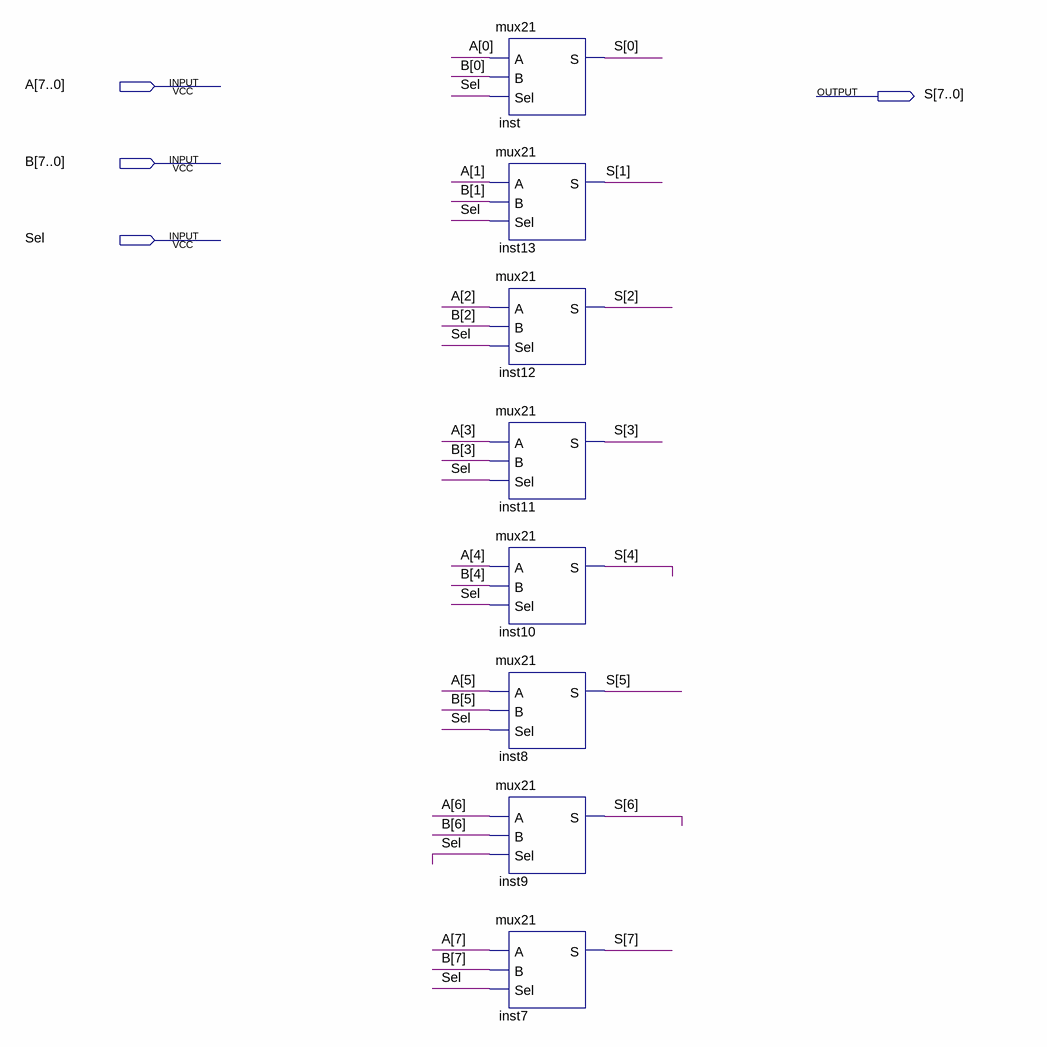
[diagram p0: schematic sheet]
// Quartus schematic lab02.bdf as structural Verilog: 8 symbols, 4 pins
module lab02 (
  input  [7:0] A,
  input  [7:0] B,
  input  Sel,
  output [7:0] S
);

  mux21 inst (.A(A[0]), .B(B[0]), .Sel(Sel), .S(S[0]));
  mux21 inst13 (.A(A[1]), .B(B[1]), .Sel(Sel), .S(S[1]));
  mux21 inst12 (.A(A[2]), .B(B[2]), .Sel(Sel), .S(S[2]));
  mux21 inst11 (.A(A[3]), .B(B[3]), .Sel(Sel), .S(S[3]));
  mux21 inst10 (.A(A[4]), .B(B[4]), .Sel(Sel), .S(S[4]));
  mux21 inst8 (.A(A[5]), .B(B[5]), .Sel(Sel), .S(S[5]));
  mux21 inst9 (.A(A[6]), .B(B[6]), .Sel(Sel), .S(S[6]));
  mux21 inst7 (.A(A[7]), .B(B[7]), .Sel(Sel), .S(S[7]));
endmodule
